# EasyEDA schematic sweet board_2020-08-14_14-36-53.json

## Sheets
1 Sheet_1
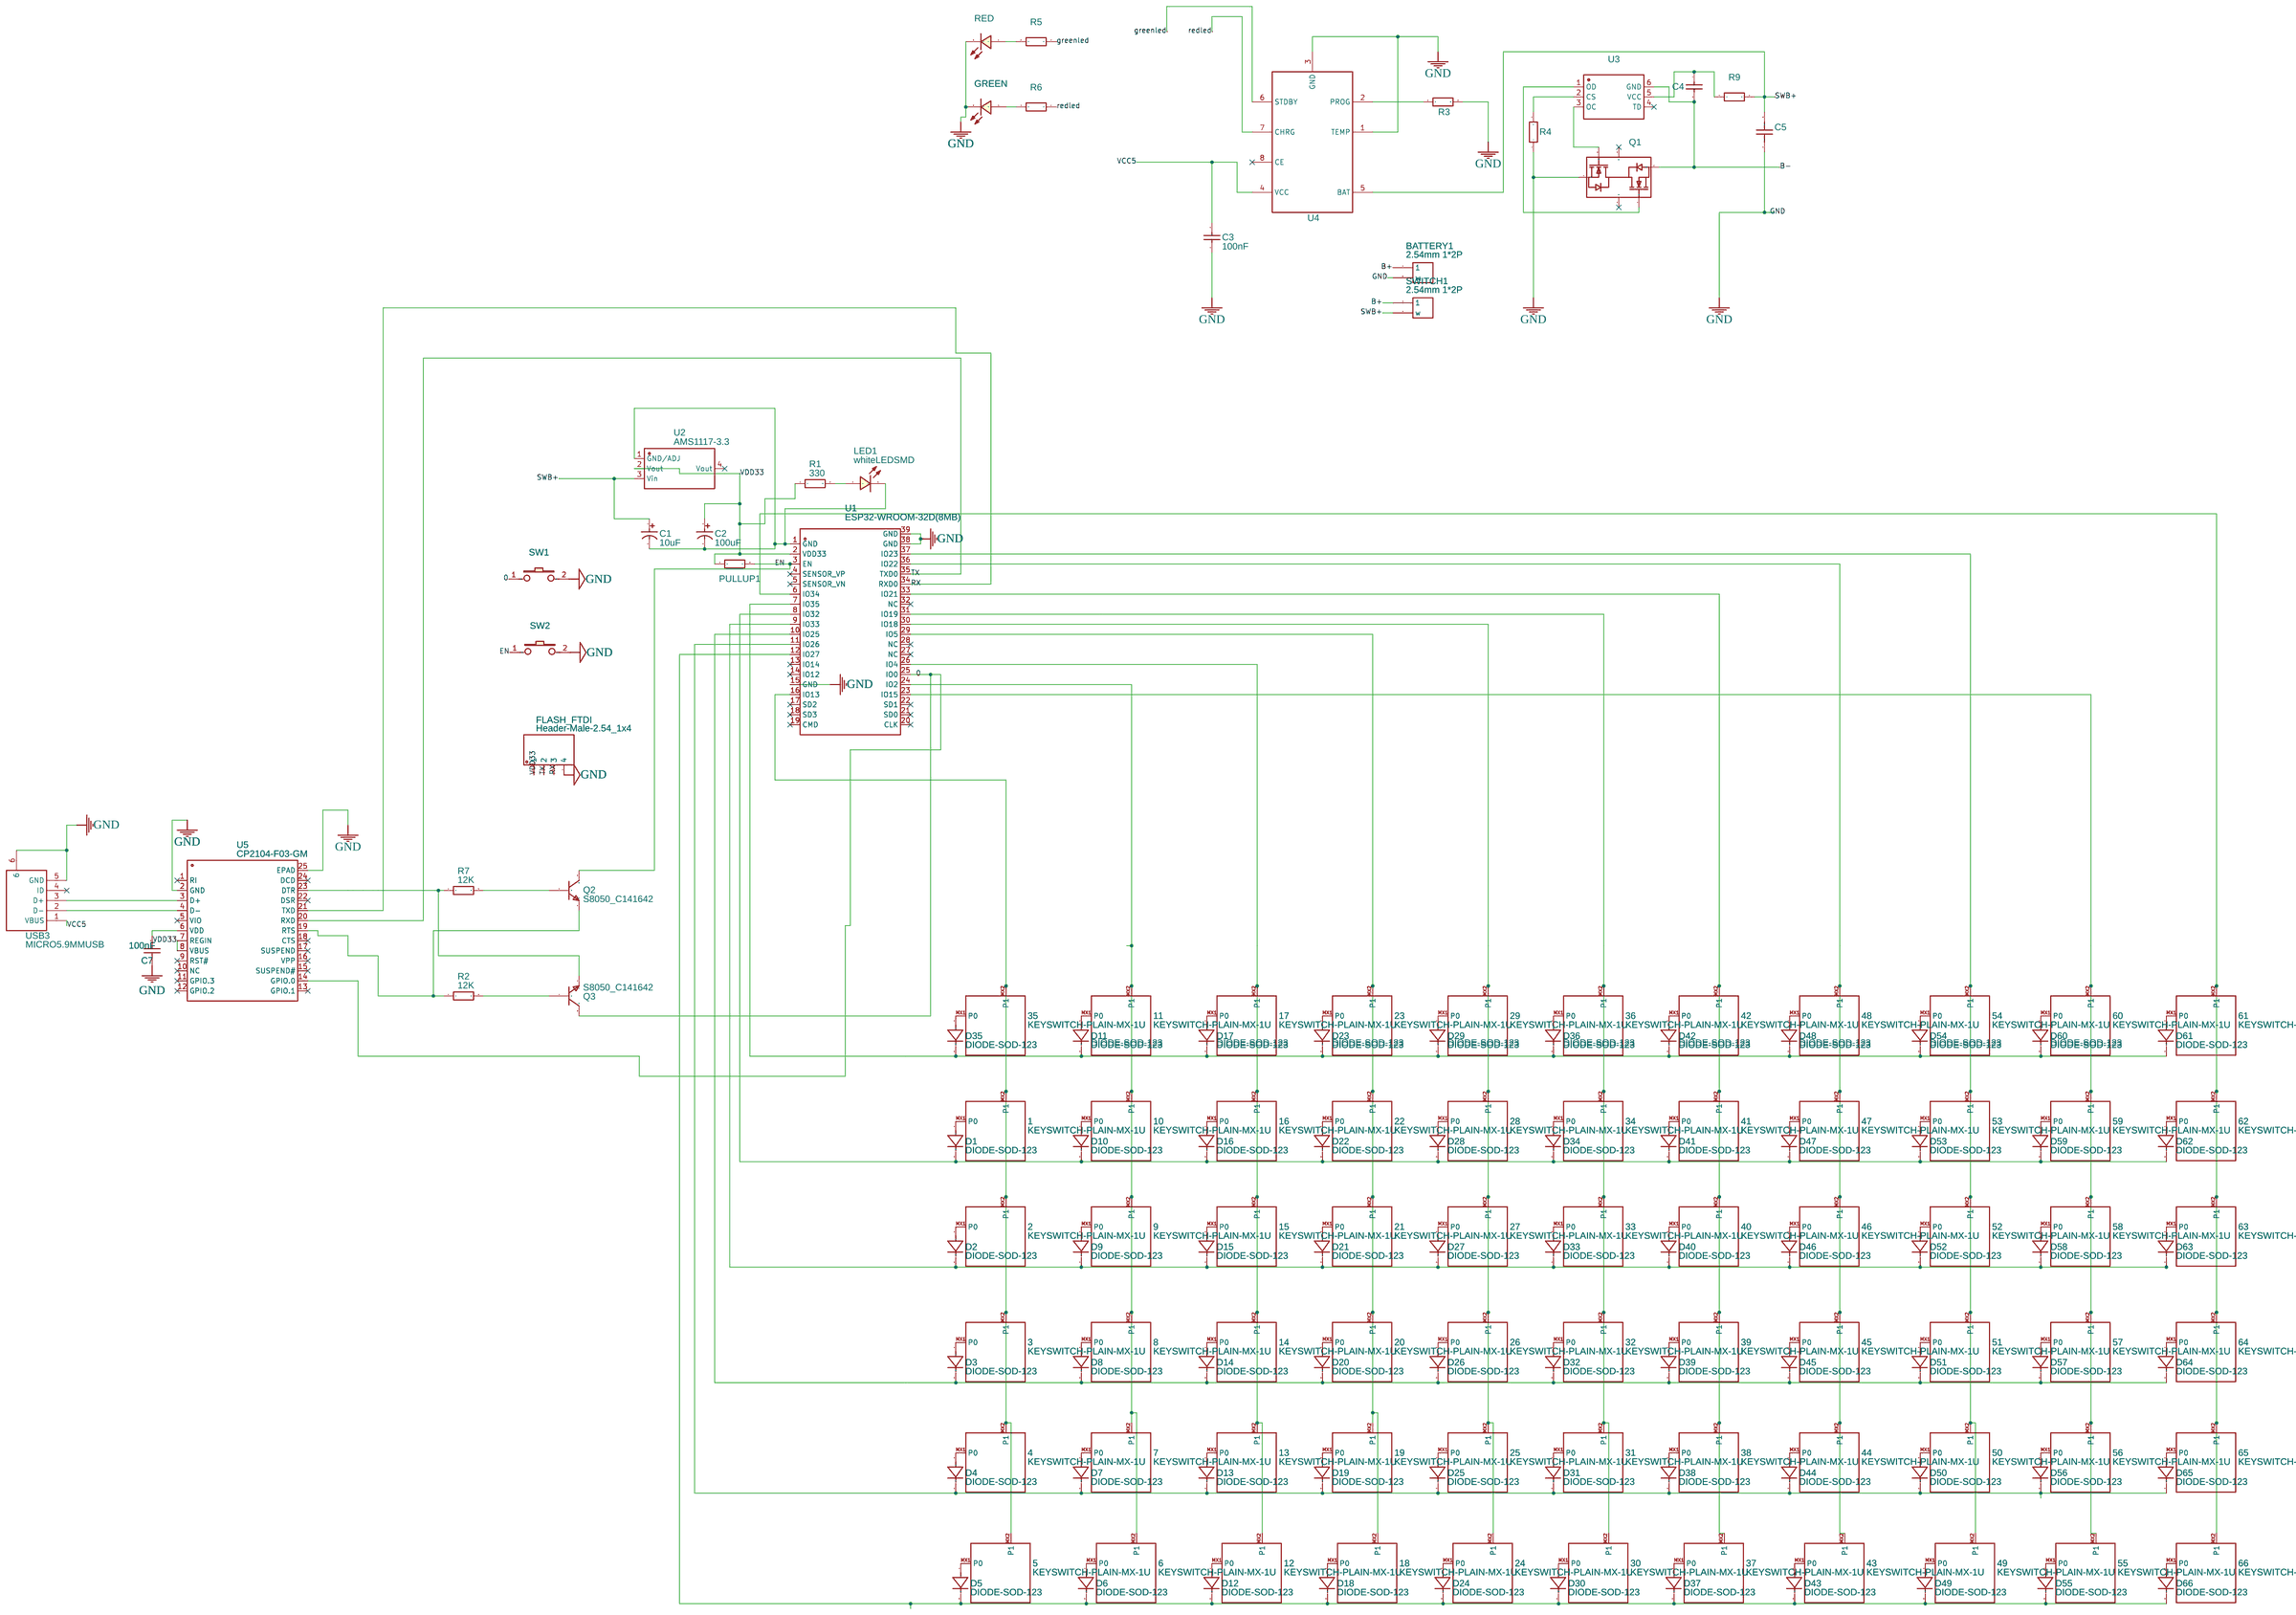
[diagram p0: Sheet_1]
2 over_under_charge: TITLE: Sheet_1; REV: 1.0; Date: 2020-07-29; Sheet: 1/1; Drawn By: YASHIKSINGH9; Company: Your Company
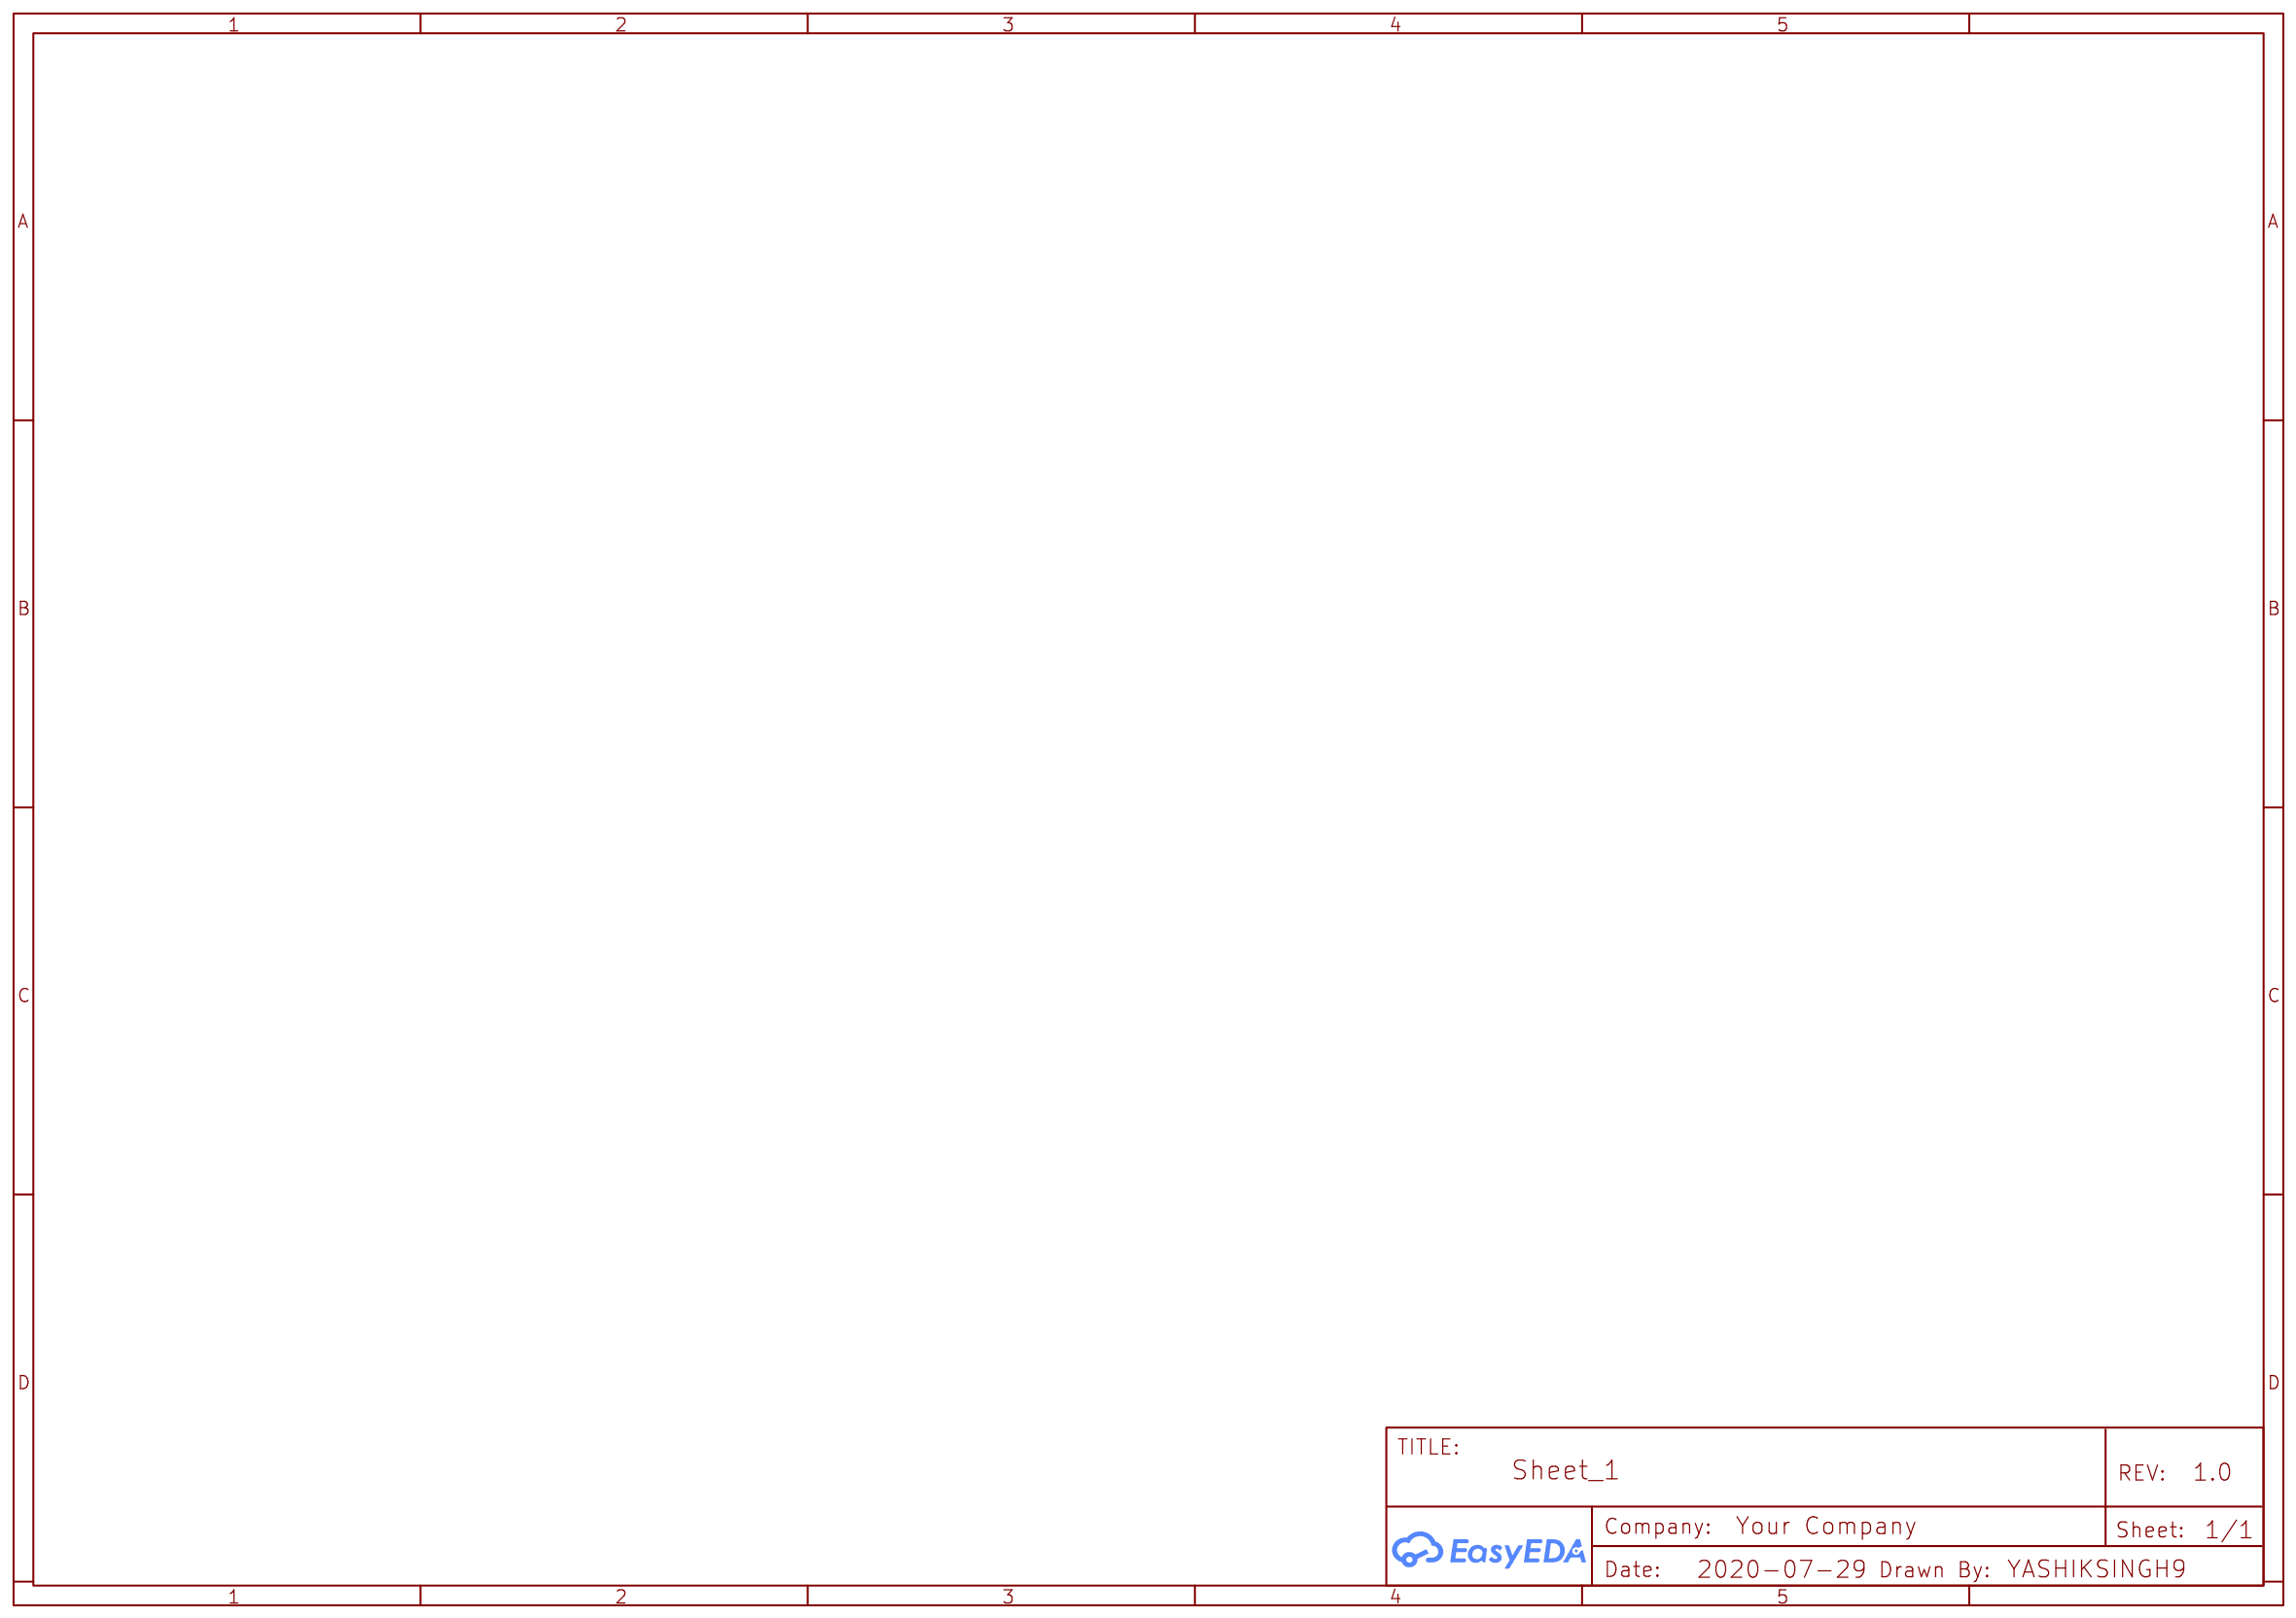
[diagram p1: over_under_charge]

## Parts
1  KEYSWITCH-PLAIN-MX-1U  [MX-1U]
2  KEYSWITCH-PLAIN-MX-1U  [MX-1U]
3  KEYSWITCH-PLAIN-MX-1U  [MX-1U]
4  KEYSWITCH-PLAIN-MX-1U  [MX-1U]
5  KEYSWITCH-PLAIN-MX-1U  [MX-1U]
6  KEYSWITCH-PLAIN-MX-1U  [MX-1U]
7  KEYSWITCH-PLAIN-MX-1U  [MX-1U]
8  KEYSWITCH-PLAIN-MX-1U  [MX-1U]
9  KEYSWITCH-PLAIN-MX-1U  [MX-1U]
10  KEYSWITCH-PLAIN-MX-1U  [MX-1U]
11  KEYSWITCH-PLAIN-MX-1U  [MX-1U]
12  KEYSWITCH-PLAIN-MX-1U  [MX-1U]
13  KEYSWITCH-PLAIN-MX-1U  [MX-1U]
14  KEYSWITCH-PLAIN-MX-1U  [MX-1U]
15  KEYSWITCH-PLAIN-MX-1U  [MX-1U]
16  KEYSWITCH-PLAIN-MX-1U  [MX-1U]
17  KEYSWITCH-PLAIN-MX-1U  [MX-1U]
18  KEYSWITCH-PLAIN-MX-1U  [MX-1U]
19  KEYSWITCH-PLAIN-MX-1U  [MX-1U]
20  KEYSWITCH-PLAIN-MX-1U  [MX-1U]
21  KEYSWITCH-PLAIN-MX-1U  [MX-1U]
22  KEYSWITCH-PLAIN-MX-1U  [MX-1U]
23  KEYSWITCH-PLAIN-MX-1U  [MX-1U]
24  KEYSWITCH-PLAIN-MX-1U  [MX-1U]
25  KEYSWITCH-PLAIN-MX-1U  [MX-1U]
26  KEYSWITCH-PLAIN-MX-1U  [MX-1U]
27  KEYSWITCH-PLAIN-MX-1U  [MX-1U]
28  KEYSWITCH-PLAIN-MX-1U  [MX-1U]
29  KEYSWITCH-PLAIN-MX-1U  [MX-1U]
30  KEYSWITCH-PLAIN-MX-1U  [MX-1U]
31  KEYSWITCH-PLAIN-MX-1U  [MX-1U]
32  KEYSWITCH-PLAIN-MX-1U  [MX-1U]
33  KEYSWITCH-PLAIN-MX-1U  [MX-1U]
34  KEYSWITCH-PLAIN-MX-1U  [MX-1U]
35  KEYSWITCH-PLAIN-MX-1U  [MX-1U]
36  KEYSWITCH-PLAIN-MX-1U  [MX-1U]
37  KEYSWITCH-PLAIN-MX-1U  [MX-1U]
38  KEYSWITCH-PLAIN-MX-1U  [MX-1U]
39  KEYSWITCH-PLAIN-MX-1U  [MX-1U]
40  KEYSWITCH-PLAIN-MX-1U  [MX-1U]
41  KEYSWITCH-PLAIN-MX-1U  [MX-1U]
42  KEYSWITCH-PLAIN-MX-1U  [MX-1U]
43  KEYSWITCH-PLAIN-MX-1U  [MX-1U]
44  KEYSWITCH-PLAIN-MX-1U  [MX-1U]
45  KEYSWITCH-PLAIN-MX-1U  [MX-1U]
46  KEYSWITCH-PLAIN-MX-1U  [MX-1U]
47  KEYSWITCH-PLAIN-MX-1U  [MX-1U]
48  KEYSWITCH-PLAIN-MX-1U  [MX-1U]
49  KEYSWITCH-PLAIN-MX-1U  [MX-1U]
50  KEYSWITCH-PLAIN-MX-1U  [MX-1U]
51  KEYSWITCH-PLAIN-MX-1U  [MX-1U]
52  KEYSWITCH-PLAIN-MX-1U  [MX-1U]
53  KEYSWITCH-PLAIN-MX-1U  [MX-1U]
54  KEYSWITCH-PLAIN-MX-1U  [MX-1U]
55  KEYSWITCH-PLAIN-MX-1U  [MX-1U]
56  KEYSWITCH-PLAIN-MX-1U  [MX-1U]
57  KEYSWITCH-PLAIN-MX-1U  [MX-1U]
58  KEYSWITCH-PLAIN-MX-1U  [MX-1U]
59  KEYSWITCH-PLAIN-MX-1U  [MX-1U]
60  KEYSWITCH-PLAIN-MX-1U  [MX-1U]
61  KEYSWITCH-PLAIN-MX-1U  [MX-1U]
62  KEYSWITCH-PLAIN-MX-1U  [MX-1U]
63  KEYSWITCH-PLAIN-MX-1U  [MX-1U]
64  KEYSWITCH-PLAIN-MX-1U  [MX-1U]
65  KEYSWITCH-PLAIN-MX-1U  [MX-1U]
66  KEYSWITCH-PLAIN-MX-1U  [MX-1U]
BATTERY1  2.54mm 1*2P  [HDR-TH_2P-P2.54-V-M]
C1  10uF  [CAP-TH_BD5.0-P2.00-D0.8-FD]
C2  100uF  [CAP-TH_BD5.0-P2.00-D0.8-FD]
C3  100nF  [0603]
C4  100nF  [0603]
C5  10uF  [0603]
C7  100nF  [CAP-3.5*7.5*7.2]
D1  DIODE-SOD-123  [SOD-123]
D2  DIODE-SOD-123  [SOD-123]
D3  DIODE-SOD-123  [SOD-123]
D4  DIODE-SOD-123  [SOD-123]
D5  DIODE-SOD-123  [SOD-123]
D6  DIODE-SOD-123  [SOD-123]
D7  DIODE-SOD-123  [SOD-123]
D8  DIODE-SOD-123  [SOD-123]
D9  DIODE-SOD-123  [SOD-123]
D10  DIODE-SOD-123  [SOD-123]
D11  DIODE-SOD-123  [SOD-123]
D12  DIODE-SOD-123  [SOD-123]
D13  DIODE-SOD-123  [SOD-123]
D14  DIODE-SOD-123  [SOD-123]
D15  DIODE-SOD-123  [SOD-123]
D16  DIODE-SOD-123  [SOD-123]
D17  DIODE-SOD-123  [SOD-123]
D18  DIODE-SOD-123  [SOD-123]
D19  DIODE-SOD-123  [SOD-123]
D20  DIODE-SOD-123  [SOD-123]
D21  DIODE-SOD-123  [SOD-123]
D22  DIODE-SOD-123  [SOD-123]
D23  DIODE-SOD-123  [SOD-123]
D24  DIODE-SOD-123  [SOD-123]
D25  DIODE-SOD-123  [SOD-123]
D26  DIODE-SOD-123  [SOD-123]
D27  DIODE-SOD-123  [SOD-123]
D28  DIODE-SOD-123  [SOD-123]
D29  DIODE-SOD-123  [SOD-123]
D30  DIODE-SOD-123  [SOD-123]
D31  DIODE-SOD-123  [SOD-123]
D32  DIODE-SOD-123  [SOD-123]
D33  DIODE-SOD-123  [SOD-123]
D34  DIODE-SOD-123  [SOD-123]
D35  DIODE-SOD-123  [SOD-123]
D36  DIODE-SOD-123  [SOD-123]
D37  DIODE-SOD-123  [SOD-123]
D38  DIODE-SOD-123  [SOD-123]
D39  DIODE-SOD-123  [SOD-123]
D40  DIODE-SOD-123  [SOD-123]
D41  DIODE-SOD-123  [SOD-123]
D42  DIODE-SOD-123  [SOD-123]
D43  DIODE-SOD-123  [SOD-123]
D44  DIODE-SOD-123  [SOD-123]
D45  DIODE-SOD-123  [SOD-123]
D46  DIODE-SOD-123  [SOD-123]
D47  DIODE-SOD-123  [SOD-123]
D48  DIODE-SOD-123  [SOD-123]
D49  DIODE-SOD-123  [SOD-123]
D50  DIODE-SOD-123  [SOD-123]
D51  DIODE-SOD-123  [SOD-123]
D52  DIODE-SOD-123  [SOD-123]
D53  DIODE-SOD-123  [SOD-123]
D54  DIODE-SOD-123  [SOD-123]
D55  DIODE-SOD-123  [SOD-123]
D56  DIODE-SOD-123  [SOD-123]
D57  DIODE-SOD-123  [SOD-123]
D58  DIODE-SOD-123  [SOD-123]
D59  DIODE-SOD-123  [SOD-123]
D60  DIODE-SOD-123  [SOD-123]
D61  DIODE-SOD-123  [SOD-123]
D62  DIODE-SOD-123  [SOD-123]
D63  DIODE-SOD-123  [SOD-123]
D64  DIODE-SOD-123  [SOD-123]
D65  DIODE-SOD-123  [SOD-123]
D66  DIODE-SOD-123  [SOD-123]
FLASH_FTDI  Header-Male-2.54_1x4  [210S-1X4P]
GREEN  green  [LED-0805]
LED1  whiteLEDSMD  [LED-0805]
PULLUP1  10k  [0603]
Q1  FS8205  [SOT-23-6]
Q2  S8050_C141642  [TO-92-3_L4.9-W3.7-P1.27-L]
Q3  S8050_C141642  [TO-92-3_L4.9-W3.7-P1.27-L]
R1  330  [RES-TH_BD2.3-L6.5-P6.9-D0.5]
R2  12K  [RES-TH_BD3.3-L9.0-P13.00-D0.6]
R3  1.2KΩ  [0603]
R4  1K  [0603]
R5  220  [0603]
R6  220  [0603]
R7  12K  [RES-TH_BD3.3-L9.0-P13.00-D0.6]
R9  100Ω  [0603]
RED  red  [LED-0805]
SW1  3*6*2.5_SMD_Tactile_Switch  [KEY-3.0*6.0]
SW2  3*6*2.5_SMD_Tactile_Switch  [KEY-3.0*6.0]
SWITCH1  2.54mm 1*2P  [HDR-TH_2P-P2.54-V-M]
U1  ESP32-WROOM-32D(8MB)  [WIFIM-SMD_39P-L25.5-W18.0-P1.27]
U2  AMS1117-3.3  [SOT-223-3_L6.5-W3.4-P2.30-LS7.0-BR]
U3  DW01A  [SOT-23-6L]
U4  TP4056  [SOP-8_EP_150MIL]
U5  CP2104-F03-GM  [QFN-24_L4.0-W4.0-P0.50-BL-EP2.8]
USB3  MICRO5.9MMUSB  [MICRO-USB-SMD_5P-P0.65-H-F_MICRO5.9MMUSB]

## Library data of the parts
1-66 = KEYSWITCH-PLAIN-MX-1U: Contributor: iLikeCake
BATTERY1 SWITCH1 = 2.54mm 1*2P: Supplier: LCSC; Manufacturer: ReliaPro; image: http://image.lceda.cn/szlcsc/C36717.jpg; Supplier Part: C36717; Package Display: No
C1 = 10uF 25V 5*11: Supplier: LCSC; Manufacturer: ValuePro; Supplier Part: C43347
C2 = 100uF 25V 5*11: Supplier: LCSC; Manufacturer: ValuePro; Supplier Part: C47873
C3 = 0603B104K250: Supplier: LCSC; Manufacturer: WTC; Supplier Part: C83054
C4 = 0603B104K250: Supplier: LCSC; Manufacturer: WTC; Supplier Part: C83054; Package Display: No
C5 = CL10A106MP8NNNC: Supplier: LCSC; Manufacturer: SAMSUNG; Supplier Part: C85713; Package Display: No
C7 = Calibration capacitor100nF（104）100V,5%: Supplier: LCSC; Manufacturer: ReliaPro; Supplier Part: C26609
D1-D66 = DIODE-SOD-123: Contributor: iLikeCake
FLASH_FTDI = -: Supplier: LCSC; Manufacturer: Ckmtw; Manufacturer Part: 210S-1*4P L=11.6MMGold-plated black; Contributor: LCSC; Supplier Part: C124378
GREEN RED = whiteLEDSMD: Supplier: LCSC; Manufacturer: KENTO; LCSC Assembly: Yes; image: //image.lceda.cn/szlcsc/C34499.jpg; Supplier Part: C34499; SMT Type: Basic; Package Display: No
LED1 = whiteLEDSMD: Supplier: LCSC; Manufacturer: KENTO; LCSC Assembly: Yes; image: //image.lceda.cn/szlcsc/C34499.jpg; Supplier Part: C34499; SMT Type: Basic
PULLUP1 R5 R6 = RS-03K000JT: Supplier: LCSC; Manufacturer: FH; Supplier Part: C115304; Package Display: No
Q1 = -: Supplier: LCSC; Manufacturer: FORTUNE; LCSC Assembly: Yes; image: //image.lceda.cn/szlcsc/C32254.jpg; Supplier Part: C32254; Package Display: No
Q2 Q3 = S8050_C141642: Supplier: LCSC; Manufacturer: CJ; Manufacturer Part: S8050; Contributor: 立创EDA官方封装库; Supplier Part: C141642
R1 = 330Ω (331) ±5%: Supplier: LCSC; Supplier Part: C10322; Manufacturer: Made in China; Contributor: LCSC
R2 R7 = RN1/2W12KΩFT/BA1: Supplier: LCSC; Supplier Part: C385571; Manufacturer: TyoHM; Contributor: LCSC
R3 = RC0603JR-071K2L: Supplier: LCSC; Manufacturer: YAGEO; Supplier Part: C114679; Package Display: No
R4 = ERJ3GEYJ102V: Supplier: LCSC; Manufacturer: PANASONIC; Contributor: LCSC; Supplier Part: C180848; Package Display: No
R9 = 0603WAJ0101T5E: Supplier: LCSC; Manufacturer: UniOhm; Supplier Part: C25201; Package Display: No
SW1 SW2 = 3*6*2.5_SMD_Tactile_Switch: Supplier Part: C66637; Supplier: LCSC; Manufacturer: ValuePro; Manufacturer Part: 6*6*12SMD Tactile Switch; Contributor: yzubkov; Package Display: No
U1 = ESP32-WROOM-32D(8MB): Supplier: LCSC; Supplier Part: C529577; Manufacturer: Espressif Systems; Contributor: LCSC
U2 = AMS1117-3.3: sourceId: dwIGgezVh; Supplier: LCSC; Manufacturer: AMS; LCSC Assembly: Yes; image: //image.lceda.cn/szlcsc/C6186.jpg; Supplier Part: C6186; SMT Type: Basic
U3 = -: Supplier: LCSC; Manufacturer: PUOLOP; Contributor: LCSC; Supplier Part: C351410; Package Display: No
U4 = -: Contributor: Guest; Supplier: LCSC; Manufacturer: TOPPOWER; LCSC Assembly: Yes; image: //image.lceda.cn/szlcsc/C16581.jpg; Supplier Part: C16581; Package Display: No
U5 = CP2104-F03-GM: Supplier: LCSC; Manufacturer: SILICON LABS; LCSC Assembly: Yes; image: //image.lceda.cn/szlcsc/C47742.jpg; Supplier Part: C47742; SMT Type: Basic
USB3 = MICRO5.9MMUSB: Supplier: LCSC; Supplier Part: C393940; Manufacturer: SHOU HAN; Manufacturer Part: MICRO5.9mmusb; Contributor: LCSC; Package Display: No

## Nets
GND: BATTERY1.2(w) C3.1 C5.1 C7.1 FLASH_FTDI.4 GREEN.2(K) Q1.1(S1) R3.2 R4.1 RED.2(K) SW1.2 SW2.2 U1.15(GND) U1.38(GND) U1.39(GND) U4.1(TEMP) U4.3(GND) U5.2(GND) U5.25(EPAD) USB3.5(GND) USB3.6
VCC5: C3.2 U4.4(VCC) USB3.1(VBUS)
VDD33: C2.1 FLASH_FTDI.1 PULLUP1.1 R1.1 U1.2(VDD33) U2.2(Vout) U5.7(REGIN) U5.8(VBUS)
0: Q3.3(C) SW1.1 U1.25(IO0) U5.14(GPIO.0)
B+: BATTERY1.1 SWITCH1.1
B-: C4.2 Q1.3(S2) U3.6(GND)
EN: PULLUP1.2 Q2.3(C) SW2.1 U1.3(EN)
greenled: R5.1 U4.6(STDBY)
redled: R6.1 U4.7(CHRG)
RX: FLASH_FTDI.3 U1.34(RXD0) U5.21(TXD)
SWB+: C1.1 C5.2 R9.2 SWITCH1.2(w) U2.3(Vin) U4.5(BAT)
TX: FLASH_FTDI.2 U1.35(TXD0) U5.20(RXD)
Net-(1-MX1): 1.MX1(P0) D1.A
Net-(1-MX2): 1.MX2(P1) 2.MX2(P1) 3.MX2(P1) 4.MX2(P1) 5.MX2(P1) 35.MX2(P1) U1.16(IO13)
Net-(2-MX1): 2.MX1(P0) D2.A
Net-(3-MX1): 3.MX1(P0) D3.A
Net-(4-MX1): 4.MX1(P0) D4.A
Net-(5-MX1): 5.MX1(P0) D5.A
Net-(6-MX1): 6.MX1(P0) D6.A
Net-(6-MX2): 6.MX2(P1) 7.MX2(P1) 8.MX2(P1) 9.MX2(P1) 10.MX2(P1) 11.MX2(P1) U1.24(IO2)
Net-(7-MX1): 7.MX1(P0) D7.A
Net-(8-MX1): 8.MX1(P0) D8.A
Net-(9-MX1): 9.MX1(P0) D9.A
Net-(10-MX1): 10.MX1(P0) D10.A
Net-(11-MX1): 11.MX1(P0) D11.A
Net-(12-MX1): 12.MX1(P0) D12.A
Net-(12-MX2): 12.MX2(P1) 13.MX2(P1) 14.MX2(P1) 15.MX2(P1) 16.MX2(P1) 17.MX2(P1) U1.26(IO4)
Net-(13-MX1): 13.MX1(P0) D13.A
Net-(14-MX1): 14.MX1(P0) D14.A
Net-(15-MX1): 15.MX1(P0) D15.A
Net-(16-MX1): 16.MX1(P0) D16.A
Net-(17-MX1): 17.MX1(P0) D17.A
Net-(18-MX1): 18.MX1(P0) D18.A
Net-(18-MX2): 18.MX2(P1) 19.MX2(P1) 20.MX2(P1) 21.MX2(P1) 22.MX2(P1) 23.MX2(P1) U1.29(IO5)
Net-(19-MX1): 19.MX1(P0) D19.A
Net-(20-MX1): 20.MX1(P0) D20.A
Net-(21-MX1): 21.MX1(P0) D21.A
Net-(22-MX1): 22.MX1(P0) D22.A
Net-(23-MX1): 23.MX1(P0) D23.A
Net-(24-MX1): 24.MX1(P0) D24.A
Net-(24-MX2): 24.MX2(P1) 25.MX2(P1) 26.MX2(P1) 27.MX2(P1) 28.MX2(P1) 29.MX2(P1) U1.30(IO18)
Net-(25-MX1): 25.MX1(P0) D25.A
Net-(26-MX1): 26.MX1(P0) D26.A
Net-(27-MX1): 27.MX1(P0) D27.A
Net-(28-MX1): 28.MX1(P0) D28.A
Net-(29-MX1): 29.MX1(P0) D29.A
Net-(30-MX1): 30.MX1(P0) D30.A
Net-(30-MX2): 30.MX2(P1) 31.MX2(P1) 32.MX2(P1) 33.MX2(P1) 34.MX2(P1) 36.MX2(P1) U1.31(IO19)
Net-(31-MX1): 31.MX1(P0) D31.A
Net-(32-MX1): 32.MX1(P0) D32.A
Net-(33-MX1): 33.MX1(P0) D33.A
Net-(34-MX1): 34.MX1(P0) D34.A
Net-(35-MX1): 35.MX1(P0) D35.A
Net-(36-MX1): 36.MX1(P0) D36.A
Net-(37-MX1): 37.MX1(P0) D37.A
Net-(37-MX2): 37.MX2(P1) 38.MX2(P1) 39.MX2(P1) 40.MX2(P1) 41.MX2(P1) 42.MX2(P1) U1.33(IO21)
Net-(38-MX1): 38.MX1(P0) D38.A
Net-(39-MX1): 39.MX1(P0) D39.A
Net-(40-MX1): 40.MX1(P0) D40.A
Net-(41-MX1): 41.MX1(P0) D41.A
Net-(42-MX1): 42.MX1(P0) D42.A
Net-(43-MX1): 43.MX1(P0) D43.A
Net-(43-MX2): 43.MX2(P1) 44.MX2(P1) 45.MX2(P1) 46.MX2(P1) 47.MX2(P1) 48.MX2(P1) U1.36(IO22)
Net-(44-MX1): 44.MX1(P0) D44.A
Net-(45-MX1): 45.MX1(P0) D45.A
Net-(46-MX1): 46.MX1(P0) D46.A
Net-(47-MX1): 47.MX1(P0) D47.A
Net-(48-MX1): 48.MX1(P0) D48.A
Net-(49-MX1): 49.MX1(P0) D49.A
Net-(49-MX2): 49.MX2(P1) 50.MX2(P1) 51.MX2(P1) 52.MX2(P1) 53.MX2(P1) 54.MX2(P1) U1.37(IO23)
Net-(50-MX1): 50.MX1(P0) D50.A
Net-(51-MX1): 51.MX1(P0) D51.A
Net-(52-MX1): 52.MX1(P0) D52.A
Net-(53-MX1): 53.MX1(P0) D53.A
Net-(54-MX1): 54.MX1(P0) D54.A
Net-(55-MX1): 55.MX1(P0) D55.A
Net-(55-MX2): 55.MX2(P1) 56.MX2(P1) 57.MX2(P1) 58.MX2(P1) 59.MX2(P1) 60.MX2(P1) U1.23(IO15)
Net-(56-MX1): 56.MX1(P0) D56.A
Net-(57-MX1): 57.MX1(P0) D57.A
Net-(58-MX1): 58.MX1(P0) D58.A
Net-(59-MX1): 59.MX1(P0) D59.A
Net-(60-MX1): 60.MX1(P0) D60.A
Net-(61-MX1): 61.MX1(P0) D61.A
Net-(61-MX2): 61.MX2(P1) 62.MX2(P1) 63.MX2(P1) 64.MX2(P1) 65.MX2(P1) 66.MX2(P1) U1.6(IO34)
Net-(62-MX1): 62.MX1(P0) D62.A
Net-(63-MX1): 63.MX1(P0) D63.A
Net-(64-MX1): 64.MX1(P0) D64.A
Net-(65-MX1): 65.MX1(P0) D65.A
Net-(66-MX1): 66.MX1(P0) D66.A
Net-(C1-2): C1.2 C2.2 LED1.2(K) U1.1(GND) U2.1(GND/ADJ)
Net-(C4-1): C4.1 R9.1 U3.5(VCC)
Net-(C7-2): C7.2 U5.6(VDD)
Net-(D1-C): D1.C D10.C D16.C D22.C D28.C D34.C D41.C D47.C D53.C D59.C D62.C U1.8(IO32)
Net-(D2-C): D2.C D9.C D15.C D21.C D27.C D33.C D40.C D46.C D52.C D58.C D63.C U1.9(IO33)
Net-(D3-C): D3.C D8.C D14.C D20.C D26.C D32.C D39.C D45.C D51.C D57.C D64.C U1.10(IO25)
Net-(D4-C): D4.C D7.C D13.C D19.C D25.C D31.C D38.C D44.C D50.C D56.C D65.C U1.11(IO26)
Net-(D5-C): D5.C D6.C D12.C D18.C D24.C D30.C D37.C D43.C D49.C D55.C D66.C U1.12(IO27)
Net-(D11-C): D11.C D17.C D23.C D29.C D35.C D36.C D42.C D48.C D54.C D60.C D61.C U1.7(IO35)
Net-(GREEN-1): GREEN.1(A) R6.2
Net-(LED1-1): LED1.1(A) R1.2
Net-(Q1-4): Q1.4(G2) U3.1(OD)
Net-(Q1-6): Q1.6(G1) U3.3(OC)
Net-(Q2-1): Q2.1(E) R2.1 U5.19(RTS)
Net-(Q2-2): Q2.2(B) R7.2
Net-(Q3-1): Q3.1(E) R7.1 U5.23(DTR)
Net-(Q3-2): Q3.2(B) R2.2
Net-(R3-1): R3.1 U4.2(PROG)
Net-(R4-2): R4.2 U3.2(CS)
Net-(R5-2): R5.2 RED.1(A)
Net-(U5-3): U5.3(D+) USB3.3(D+)
Net-(U5-4): U5.4(D-) USB3.2(D-)

Not connected (* = marked no-connect by the designer): Q1 2(D12)* 5(D12)*; U1 4(SENSOR_VP)* 5(SENSOR_VN)* 13(IO14)* 14(IO12)* 17(SD2)* 18(SD3)* 19(CMD)* 20(CLK)* 21(SD0)* 22(SD1)* 27(NC)* 28(NC)* 32(NC)*; U2 4(Vout)*; U3 4(TD)*; U4 8(CE)*; U5 1(RI)* 5(VIO)* 9(RST#)* 10(NC)* 11(GPIO.3)* 12(GPIO.2)* 13(GPIO.1)* 15(SUSPEND#)* 16(VPP)* 17(SUSPEND)* 18(CTS)* 22(DSR)* 24(DCD)*; USB3 4(ID)*

## Notes on the sheets
sheet 1
- DIODE-SOD-123
- DIODE-SOD-123
- DIODE-SOD-123
- DIODE-SOD-123
- DIODE-SOD-123
- DIODE-SOD-123
- DIODE-SOD-123
- DIODE-SOD-123
- DIODE-SOD-123
